# EAGLE design LEDPCB (EAGLE 8.2.0)
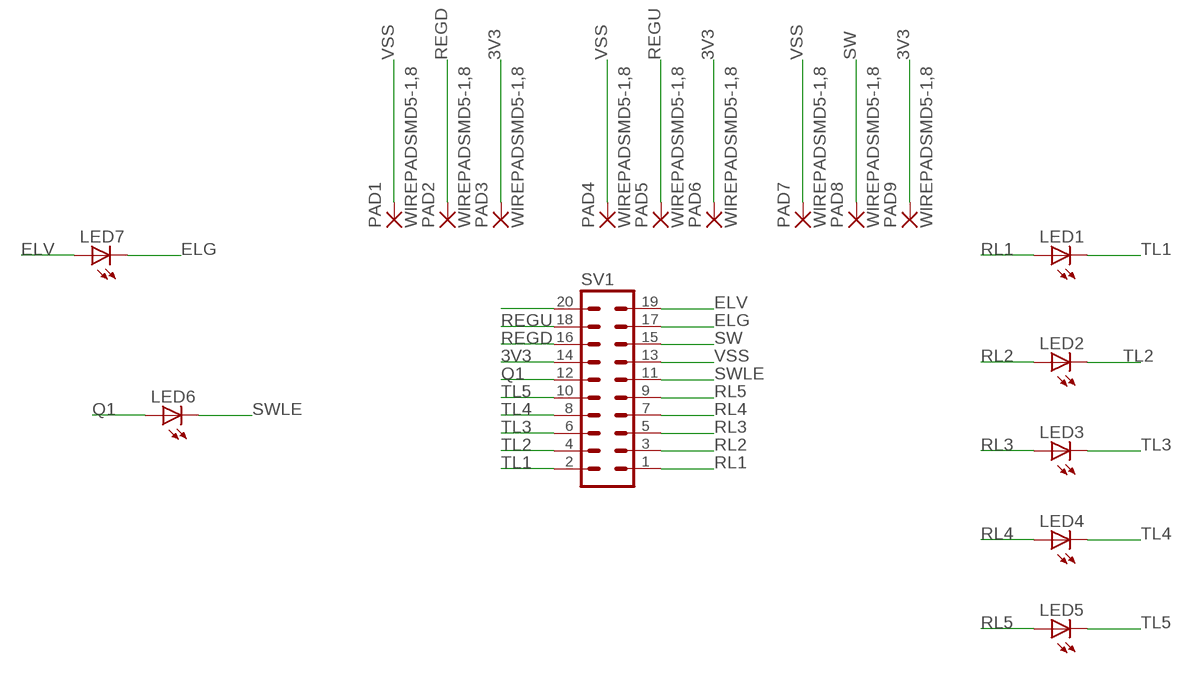
[diagram p0: schematic, sheet 1]

## Parts
LED1  LEDSMT1206  [1206]
LED2  LEDSMT1206  [1206]
LED3  LEDSMT1206  [1206]
LED4  LEDSMT1206  [1206]
LED5  LEDSMT1206  [1206]
LED6  LEDSMT1206  [1206]
LED7  LEDSMT1206  [1206]
PAD1  WIREPADSMD5-1,8  [5-1,8]
PAD2  WIREPADSMD5-1,8  [5-1,8]
PAD3  WIREPADSMD5-1,8  [5-1,8]
PAD4  WIREPADSMD5-1,8  [5-1,8]
PAD5  WIREPADSMD5-1,8  [5-1,8]
PAD6  WIREPADSMD5-1,8  [5-1,8]
PAD7  WIREPADSMD5-1,8  [5-1,8]
PAD8  WIREPADSMD5-1,8  [5-1,8]
PAD9  WIREPADSMD5-1,8  [5-1,8]
SV1  MA10-2  [MA10-2]

## Nets
3V3: PAD3.1(P) PAD6.1(P) PAD9.1(P) SV1.14
ELG: LED7.C SV1.17
ELV: LED7.A SV1.19
N$2: SV1.20
Q1: LED6.A SV1.12
REGD: PAD2.1(P) SV1.16
REGU: PAD5.1(P) SV1.18
RL1: LED1.A SV1.1
RL2: LED2.A SV1.3
RL3: LED3.A SV1.5
RL4: LED4.A SV1.7
RL5: LED5.A SV1.9
SW: PAD8.1(P) SV1.15
SWLE: LED6.C SV1.11
TL1: LED1.C SV1.2
TL2: LED2.C SV1.4
TL3: LED3.C SV1.6
TL4: LED4.C SV1.8
TL5: LED5.C SV1.10
VSS: PAD1.1(P) PAD4.1(P) PAD7.1(P) SV1.13

## Library data of the parts
LED1-LED7 = adafruit:LED: LED OSRAM: - CHIPLED LG R971, LG N971, LY N971, LG Q971, LY Q971, LO R971, LY R971 LH N974, LH R974 LS Q976, LO Q976, LY Q976 LO Q996 - Hyper CHIPLED LW Q18S LB Q993, LB Q99A, LB R99A - SideLED LS A670, LO A670, LY A670, LG A670, LP A670 LB A673, LV A673, LT A673, LW A673 LH A674 LY A675 LS A676, LA A676, LO A676, LY A676, LW A676 LS A679, LY A679, LG A679 - Hyper Micro SIDELED® LS Y876, LA Y876, LO Y876, LY Y876 LT Y87S - SmartLED LW L88C, LW L88S LB L89C, LB L89S, LG L890 LS L89K, LO L89K, LY L89K LS L896, LA L896, LO L896, LY L896 - TOPLED LS T670, LO T670, LY T670, LG T670, LP T670 LSG T670, LSP T670, LSY T670, LOP T670, LYG T670 LG T671, LOG T671, LSG T671 LB T673, LV T673, LT T673, LW T673 LH T674 LS T676, LA T676, LO T676, LY T676, LB T676, LH T676, LSB T676, LW T676 LB T67C, LV T67C, LT T67C, LS T67K, LO T67K, LY T67K, LW E67C LS E67B, LA E67B, LO E67B, LY E67B, LB E67C, LV E67C, LT E67C LW T67C LS T679, LY T679, LG T679 LS T770, LO T770, LY T770, LG T770, LP T770 LB T773, LV T773, LT T773, LW T773 LH T774 LS E675, LA E675, LY E675, LS T675 LS T776, LA T776, LO T776, LY T776, LB T776 LHGB T686 LT T68C, LB T68C - Hyper Mini TOPLED® LB M676 - Mini TOPLED Santana® LG M470 LS M47K, LO M47K, LY M47K Source: http://www.osram.convergy.de/
PAD1-PAD9 = wirepad:WIREPAD: Wire PAD connect wire on PCB
SV1 = con-lstb:MA10-2: PIN HEADER; OC_FARNELL: unknown; OC_NEWARK: unknown

## Board
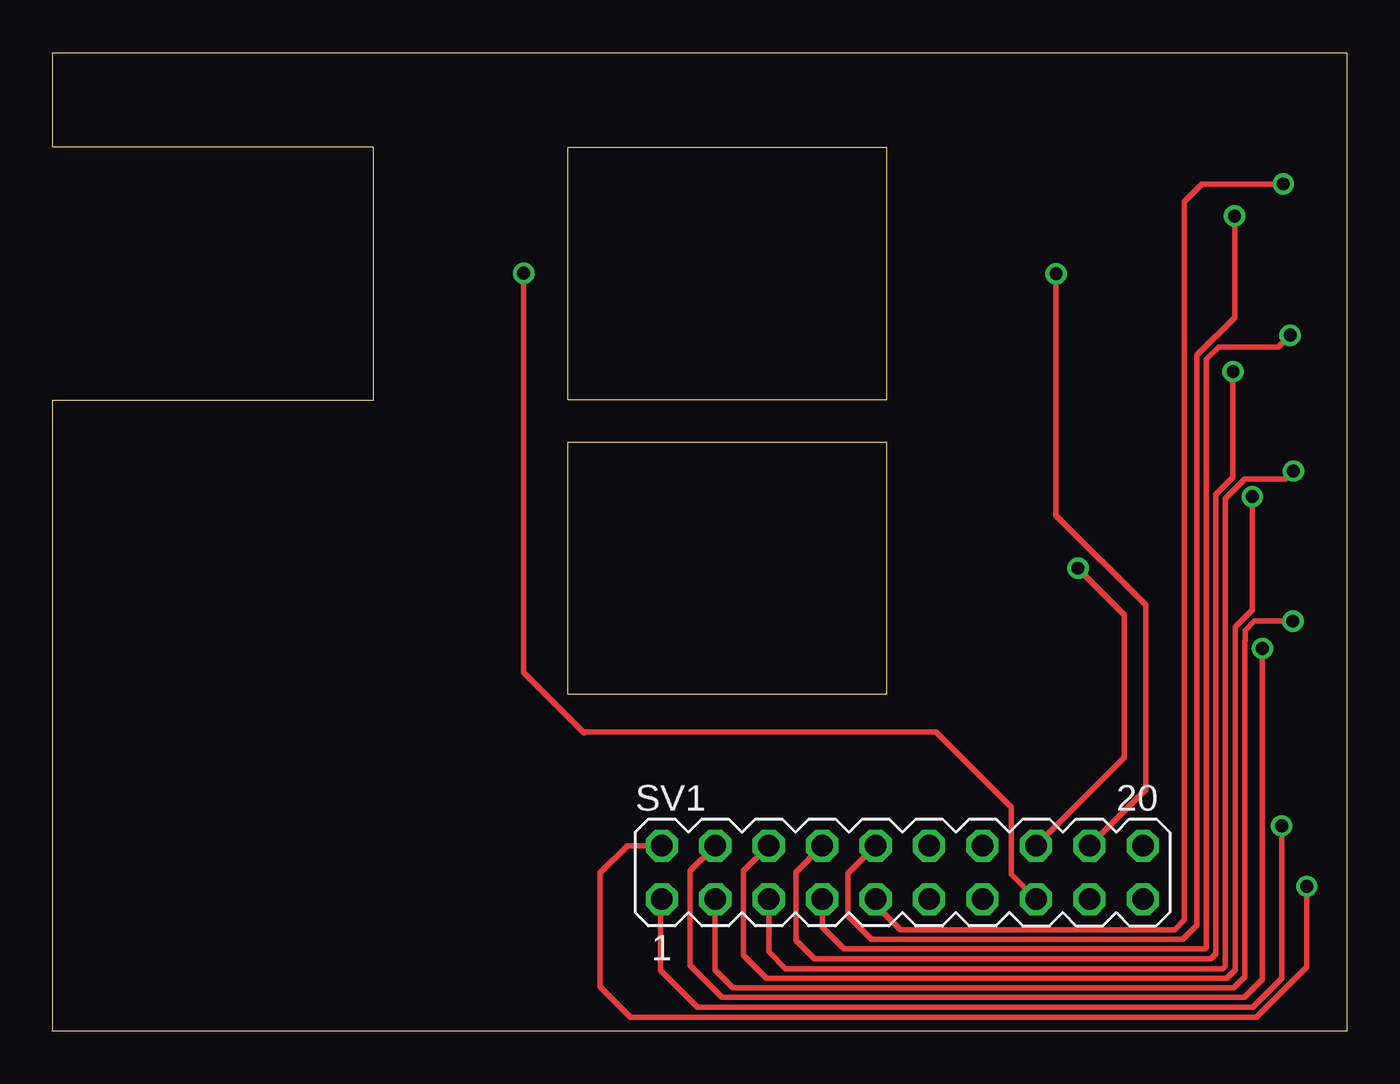
[diagram p1: board, top side]
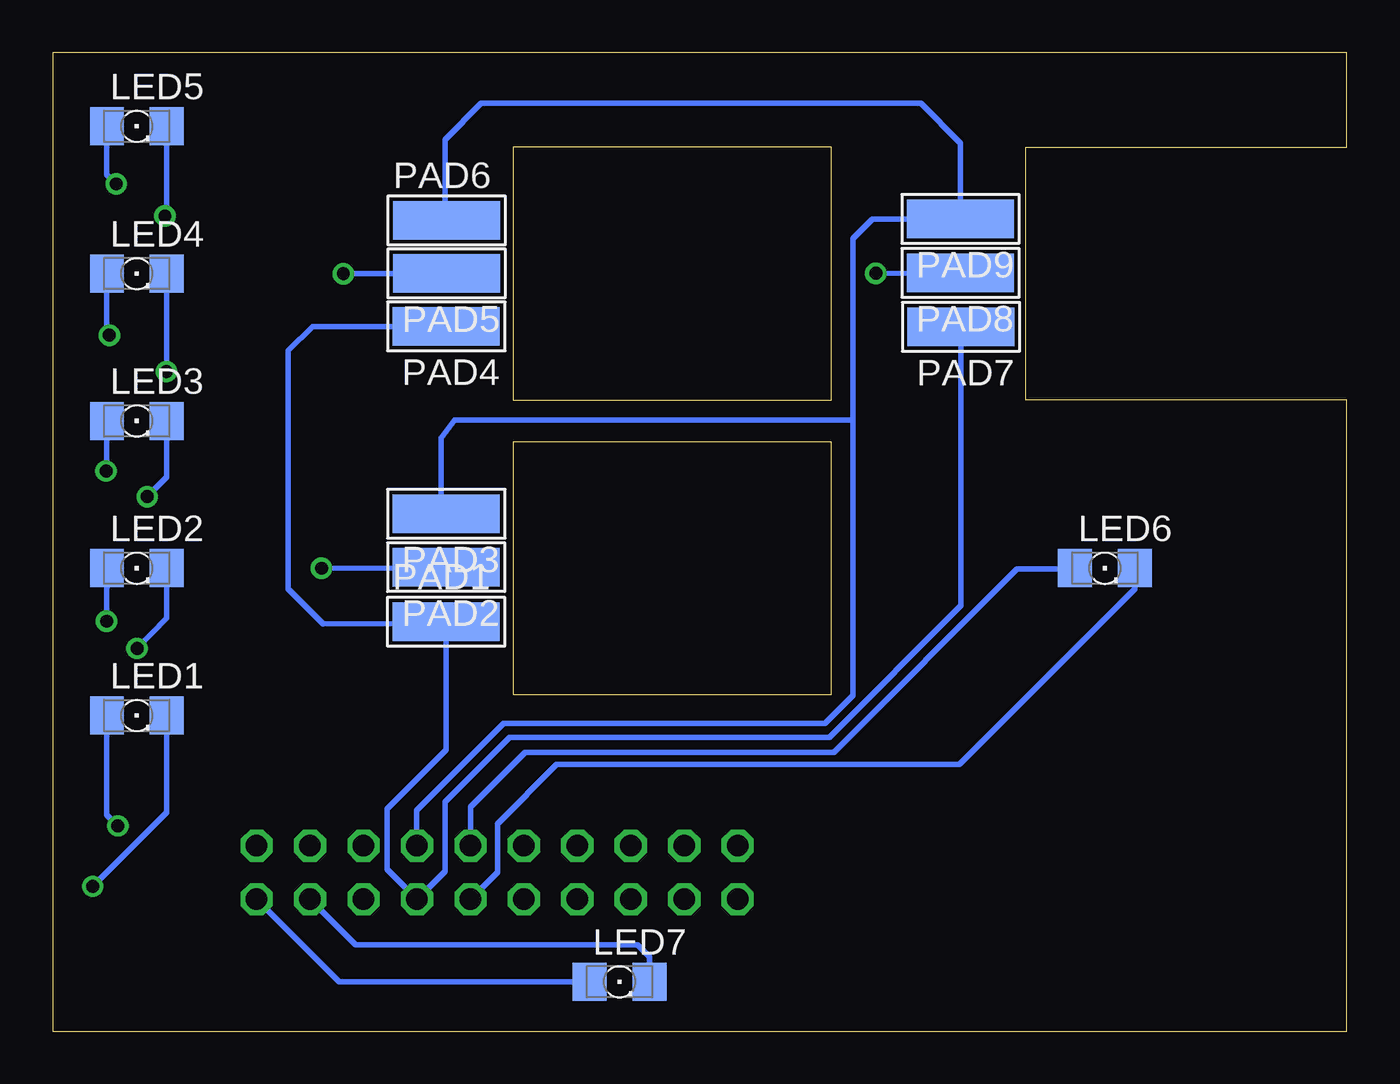
[diagram p2: board, bottom side, seen from below]

Size 61.5 x 46.5 mm. Coordinates in mm from the lower left corner, seen from the top.
Outline: 24.5,30 24.5,42 39.62,42 39.62,30 24.5,30
Outline: 24.5,16 24.5,28 39.62,28 39.62,16 24.5,16
Outline: 0,0 0,30 15.25,30 15.25,42 0,42 0,46.5 61.5,46.5 61.5,0 0,0
Copper layers (1*16): Top 0.035mm / dielectric 1.5mm / Bottom 0.035mm
Design rules "default *": minimum track width 10mil, minimum drill 24mil, track to track 8mil, track to pad 8mil, pad to pad 8mil, via to via 8mil, smd to smd 8mil, copper to edge 20mil, drill to drill 8mil, minimum pad ring 10mil, minimum via ring 8mil, stop-mask expansion 4mil, vias tented up to drill 0mil, thermal gap 10mil

### Footprints (pad centres in the part's own frame; a part is rotated, then mirrored left to right if it is on the bottom)
1206 = smd 1.6 x 1.803: A -1.422,0; C 1.422,0
5-1,8 = smd 1.829 x 5.08: 1 0,0
MA10-2 = drill 1.016 octagon: 1 -11.43,-1.27; 2 -11.43,1.27; 3 -8.89,-1.27; 4 -8.89,1.27; 5 -6.35,-1.27; 6 -6.35,1.27; 7 -3.81,-1.27; 8 -3.81,1.27; 9 -1.27,-1.27; 10 -1.27,1.27; 11 1.27,-1.27; 12 1.27,1.27; 13 3.81,-1.27; 14 3.81,1.27; 15 6.35,-1.27; 16 6.35,1.27; 17 8.89,-1.27; 18 8.89,1.27; 19 11.43,-1.27; 20 11.43,1.27

### Placement (x,y rotation side)
LED1  57.5,15 0 bottom
LED2  57.5,22 0 bottom
LED3  57.5,29 0 bottom
LED4  57.5,36 0 bottom
LED5  57.5,43 0 bottom
LED6  11.5,22 0 bottom
LED7  34.56,2.35 0 bottom
PAD1  42.81,19.45 270 bottom
PAD2  42.8,22.05 90 bottom
PAD3  42.79,24.59 90 bottom
PAD4  42.79,33.49 90 bottom
PAD5  42.78,36.01 90 bottom
PAD6  42.78,38.53 270 bottom
PAD7  18.33,33.47 90 bottom
PAD8  18.36,36.03 90 bottom
PAD9  18.36,38.6 90 bottom
SV1  40.38,7.54 0 top

### Tracks (layer width: path | path; a pad name or v marks a point on that pad's centre or on a via)
3V3
  Bottom 0.254: PAD9.1 22.54,38.6 23.48,37.66 23.48,29 | 23.48,29 23.51,29.03 42.4,29.03 43.05,28.18 43.05,24.84 PAD3.1 | 17.43,39.22 17.74,39.22 PAD9.1 | 42.96,38.7 PAD6.1 42.86,38.6 42.86,42.36 41.13,44.09 20.25,44.09 18.36,42.2 PAD9.1 | 23.48,29 23.48,15.95 24.8,14.63 40.06,14.63 44.2,10.49 44.2,8.82 SV1.14
ELG
  Bottom 0.254: LED7.C 33.14,3.54 33.71,4.11 47.11,4.11 SV1.17
ELV
  Bottom 0.254: LED7.A 47.89,2.35 SV1.19
Q1
  Bottom 0.254: LED6.A 12.97,21.95 15.67,21.95 24.37,13.26 39.05,13.26 41.64,10.66 41.64,8.82 SV1.12
REGD  (via drill 0.61)
  Top 0.254: v48.72,21.99 50.93,19.78 50.93,13.02 SV1.16
  Bottom 0.254: v48.72,21.99 42.83,22.02 PAD2.1
REGU  (via drill 0.61)
  Top 0.254: v47.68,35.99 47.68,24.51 51.95,20.24 51.95,11.49 SV1.18
  Bottom 0.254: v47.68,35.99 42.8,35.99 PAD5.1
RL1  (via drill 0.61)
  Top 0.254: v58.4,9.75 58.4,2.51 57.03,1.14 30.64,1.14 28.89,2.89 28.89,6.21 SV1.1
  Bottom 0.254: LED1.A 58.92,10.27 v58.4,9.75
RL2  (via drill 0.61)
  Top 0.254: v58.93,19.48 57.11,19.48 56.67,19.05 56.67,18.56 56.65,18.53 56.65,2.59 56.11,2.05 32.34,2.05 31.48,2.92 31.48,6.26 SV1.3
  Bottom 0.254: 58.91,21.11 58.91,21.99 LED2.A v58.92,19.49 v58.93,19.48
RL3  (via drill 0.61)
  Top 0.254: v58.96,26.62 58.58,26.23 56.66,26.23 55.73,25.31 55.73,3.11 55.59,2.97 34.83,2.97 34.04,3.76 34.04,6.26 SV1.5
  Bottom 0.254: LED3.A 58.92,26.65 v58.96,26.62
RL4  (via drill 0.61)
  Top 0.254: v58.81,33.07 58.25,32.51 55.4,32.51 54.82,31.92 54.82,3.99 54.74,3.91 37.6,3.91 36.58,4.92 36.58,6.26 SV1.7
  Bottom 0.254: LED4.A 58.92,33.18 v58.81,33.07
RL5  (via drill 0.61)
  Top 0.254: v58.48,40.26 54.62,40.26 53.78,39.42 53.78,5.28 53.32,4.82 40.29,4.82 39.11,6.01 SV1.9
  Bottom 0.254: LED5.A 58.92,40.7 v58.48,40.26
SW  (via drill 0.61)
  Top 0.254: 22.33,35.96 v22.38,36.01 22.38,17.04 25.2,14.22 | 25.2,14.22 25.25,14.17 | 25.2,14.22 41.97,14.22 45.55,10.64 45.55,7.45 SV1.15
  Bottom 0.254: v22.38,36.01 18.4,35.99 PAD8.1
SWLE
  Bottom 0.254: LED6.C 10.08,21.02 18.42,12.67 37.55,12.67 40.37,9.85 40.37,7.55 SV1.11
TL1  (via drill 0.61)
  Top 0.254: v59.59,6.88 59.59,3.04 57.21,0.66 27.46,0.66 26.02,2.11 26.02,7.52 27.31,8.81 SV1.2
  Bottom 0.254: LED1.C 56.08,10.4 v59.59,6.88
TL2  (via drill 0.61)
  Top 0.254: v57.49,18.18 57.49,2.46 56.62,1.6 31.81,1.6 30.28,3.12 30.28,7.61 SV1.4
  Bottom 0.254: LED2.C 56.08,19.64 v57.49,18.18
TL3  (via drill 0.61)
  Top 0.254: v57,25.4 57,20.02 56.19,19.21 56.19,2.92 55.78,2.51 36.3,2.51 33.92,2.51 32.82,3.6 32.82,7.61 SV1.6
  Bottom 0.254: LED3.C 56.08,26.32 v57,25.4
TL4  (via drill 0.61)
  Top 0.254: v56.09,31.34 56.09,26.32 55.28,25.5 55.28,3.68 55.02,3.43 36.2,3.43 35.31,4.32 35.31,7.55 SV1.8
  Bottom 0.254: LED4.C 56.08,32.47 v56.09,31.34
TL5  (via drill 0.61)
  Top 0.254: v56.17,38.73 56.17,33.92 54.36,32.11 54.36,5.03 53.7,4.37 38.92,4.37 37.8,5.48 37.8,7.5 SV1.10
  Bottom 0.254: LED5.C 56.08,38.82 v56.17,38.73
VSS
  Bottom 0.254: 18.77,33.47 PAD7.1 18.33,20.23 24.59,13.97 39.78,13.97 42.86,10.89 42.86,7.6 SV1.13 45.6,7.68 45.6,10.56 42.81,13.36 PAD1.1 42.83,19.43 42.83,19.07 43.14,19.38 48.65,19.35 50.3,21 50.3,32.33 49.14,33.49 PAD4.1